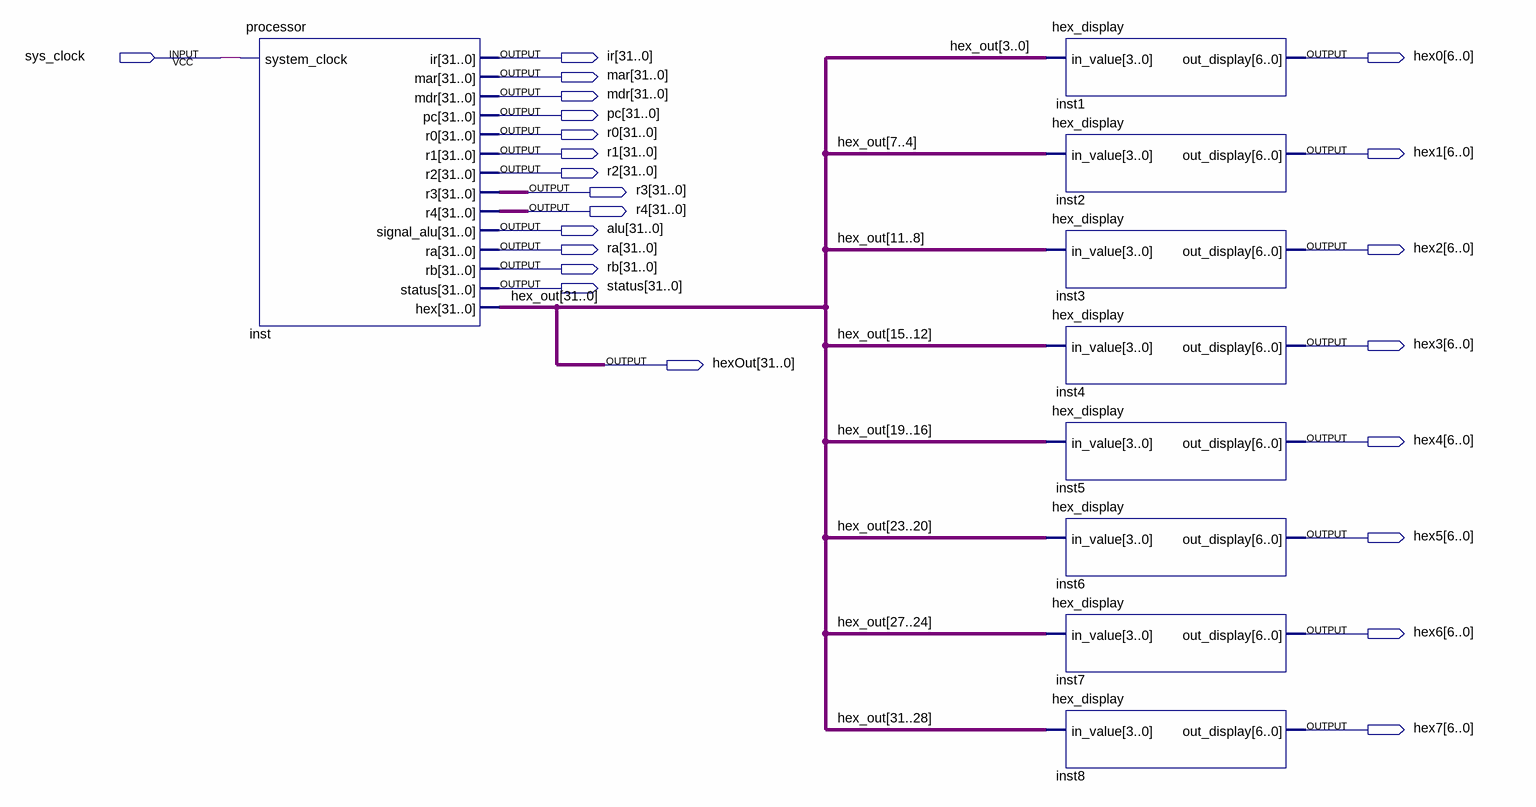
[diagram p0: schematic sheet]
// Quartus schematic display.bdf as structural Verilog: 9 symbols, 23 pins
module display (
  input  sys_clock,
  output [31:0] ir,
  output [6:0] hex0,
  output [31:0] mar,
  output [31:0] mdr,
  output [31:0] pc,
  output [31:0] r0,
  output [31:0] r1,
  output [6:0] hex1,
  output [31:0] r2,
  output [31:0] r3,
  output [31:0] r4,
  output [31:0] alu,
  output [31:0] ra,
  output [6:0] hex2,
  output [31:0] rb,
  output [31:0] status,
  output [6:0] hex3,
  output [31:0] hexOut,
  output [6:0] hex4,
  output [6:0] hex5,
  output [6:0] hex6,
  output [6:0] hex7
);

  processor inst (
    .system_clock(sys_clock), .ir(ir), .mar(mar), .mdr(mdr), .pc(pc), .r0(r0), .r1(r1), .r2(r2), .r3(r3),
    .r4(r4), .signal_alu(alu), .ra(ra), .rb(rb), .status(status), .hex(hexOut));
  hex_display inst1 (.in_value(hexOut[3:0]), .out_display(hex0));
  hex_display inst2 (.in_value(hexOut[7:4]), .out_display(hex1));
  hex_display inst3 (.in_value(hexOut[11:8]), .out_display(hex2));
  hex_display inst4 (.in_value(hexOut[15:12]), .out_display(hex3));
  hex_display inst5 (.in_value(hexOut[19:16]), .out_display(hex4));
  hex_display inst6 (.in_value(hexOut[23:20]), .out_display(hex5));
  hex_display inst7 (.in_value(hexOut[27:24]), .out_display(hex6));
  hex_display inst8 (.in_value(hexOut[31:28]), .out_display(hex7));

  // Other names for the same wires on the sheet: hex_out[31:0] = hexOut
endmodule
